# EAGLE schematic SensorInterface (EAGLE 8.5.1)

## Sheet 1 of 2
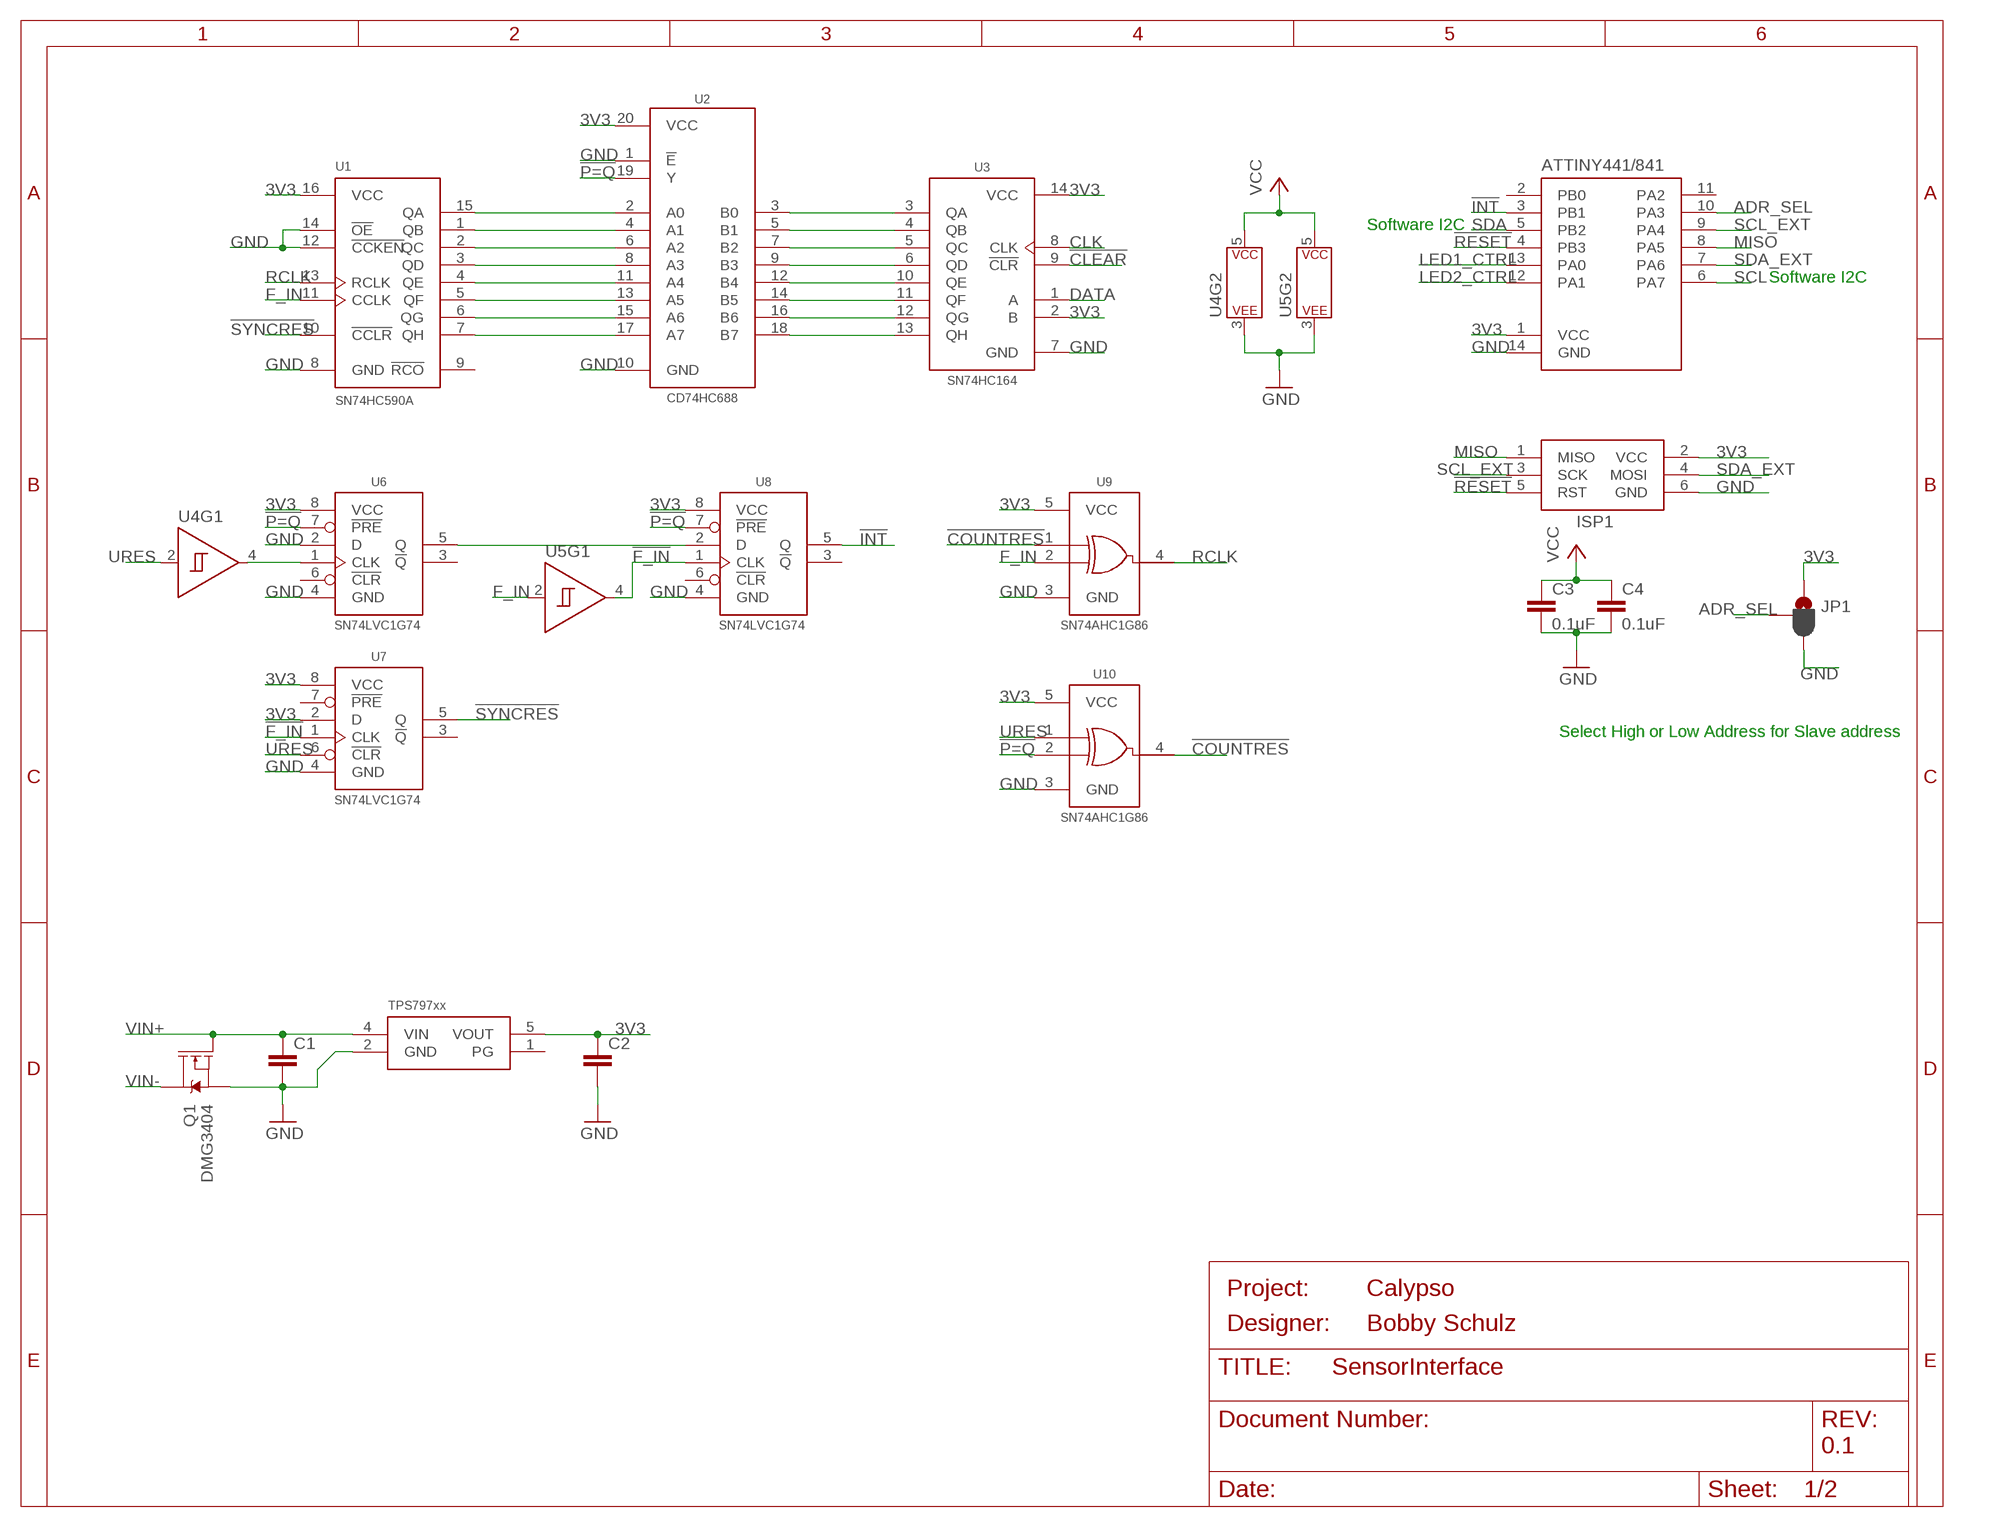
[diagram p0: schematic, sheet 1]
FRAME1 (FRAME_A_L): DESIGNER: Bobby Schulz; PROJECT: Calypso; REV: 0.1

### Parts
C1  C-EUC0603  [C0603]
C2  C-EUC0603  [C0603]
C3  0.1uF  C-EUC0603  [C0603]
C4  0.1uF  C-EUC0603  [C0603]
ISP1  AVRISP-6  [AVRISP]
JP1  JUMPER-SMT_3_1-NC_PASTE_SILK  [SMT-JUMPER_3_1-NC_PASTE_SILK]
Q1  DMG3404  MOSFET-NCH-DMG3404L  [SOT23-3]
U1  SN74HC590AD  [SO16]
U2  CD74HCT688DW  [SO-20DW]
U3  SN74HC164D  [SO14]
U4  SN74LVC1G14DCK  [DCK_R-PDSO-G5]
U5  SN74LVC1G14DCK  [DCK_R-PDSO-G5]
U6  SN74LVC1G74DCU  [DCU_(R-PDSO-G8)]
U7  SN74LVC1G74DCU  [DCU_(R-PDSO-G8)]
U8  SN74LVC1G74DCU  [DCU_(R-PDSO-G8)]
U9  SN74AHC1G86DCK  [DCK_R-PDSO-G5]
U10  SN74AHC1G86DCK  [DCK_R-PDSO-G5]
U$1  TPS79733  [DCK_R-PDSO-G5]
U$3  ATTINY441/841841  [SOIC_14]

### Nets
3V3: C2.1 C3.1 C4.1 ISP1.2(VCC) JP1.1 U1.16(VCC) U2.20(VCC) U3.2(B) U3.14(VCC) U4.5(P$V+) U5.5(P$V+) U6.8(VCC) U7.2(D) U7.8(VCC) U8.8(VCC) U9.5(VCC) U10.5(VCC) U$1.5(VOUT) U$3.1(VCC) ; supply symbol labelled VCC ; also sheet 2
!CLEAR: U3.9(!CLR)
!COUNTRES: U9.1(A) U10.4(Y)
!F_IN: U5.4(Y) U7.1(CLK) U8.1(CLK)
!INT: U8.5(Q) U$3.3(PB1)
!P=Q: U2.19(Y) U6.7(!PRE) U8.7(!PRE) U10.2(B)
!RESET: ISP1.5(RST) U$3.4(PB3)
!SYNCRES: U1.10(!CCLR) U7.5(Q)
ADR_SEL: JP1.2 U$3.10(PA3)
CLK: U3.8(CLK)
DATA: U3.1(A)
F_IN: U1.11(CCLK) U5.2(A) U9.2(B) ; also sheet 2
GND: C1.2 C2.2 C3.2 C4.2 ISP1.6(GND) JP1.3 Q1.2(S) U1.8(GND) U1.12(!CCKEN) U1.14(!OE) U2.1(!E) U2.10(GND) U3.7(GND) U4.3(P$V-) U5.3(P$V-) U6.2(D) U6.4(GND) U7.4(GND) U8.4(GND) U9.3(GND) U10.3(GND) U$1.2(GND) U$3.14(GND) ; also sheet 2
LED1_CTRL: U$3.13(PA0) ; also sheet 2
LED2_CTRL: U$3.12(PA1) ; also sheet 2
MISO: ISP1.1(MISO) U$3.8(PA5)
N$1: U1.15(QA) U2.2(A0)
N$2: U1.1(QB) U2.4(A1)
N$3: U1.2(QC) U2.6(A2)
N$4: U1.3(QD) U2.8(A3)
N$5: U1.4(QE) U2.11(A4)
N$6: U1.5(QF) U2.13(A5)
N$7: U1.6(QG) U2.15(A6)
N$8: U1.7(QH) U2.17(A7)
N$9: U2.3(B0) U3.3(QA)
N$10: U2.5(B1) U3.4(QB)
N$11: U2.7(B2) U3.5(QC)
N$12: U2.9(B3) U3.6(QD)
N$13: U2.12(B4) U3.10(QE)
N$14: U2.14(B5) U3.11(QF)
N$15: U2.16(B6) U3.12(QG)
N$16: U2.18(B7) U3.13(QH)
N$20: U4.4(Y) U6.1(CLK)
N$32: U6.5(Q) U8.2(D)
RCLK: U1.13(RCLK) U9.4(Y)
SCL: U$3.6(PA7) ; also sheet 2
SCL_EXT: ISP1.3(SCK) U$3.9(PA4) ; also sheet 2
SDA: U$3.5(PB2) ; also sheet 2
SDA_EXT: ISP1.4(MOSI) U$3.7(PA6) ; also sheet 2
URES: U4.2(A) U7.6(!CLR) U10.1(A)
VIN+: C1.1 Q1.1(G) U$1.4(VIN) ; also sheet 2
VIN-: Q1.3(D) ; also sheet 2
Unconnected: U1.9(!RCO) U6.3(!Q) U6.6(!CLR) U7.3(!Q) U7.7(!PRE) U8.3(!Q) U8.6(!CLR) U$1.1(PG) U$3.2(PB0) U$3.11(PA2)

### Notes on the sheet
- Software I2C
- Software I2C
- Select High or Low Address for Slave address

## Sheet 2 of 2
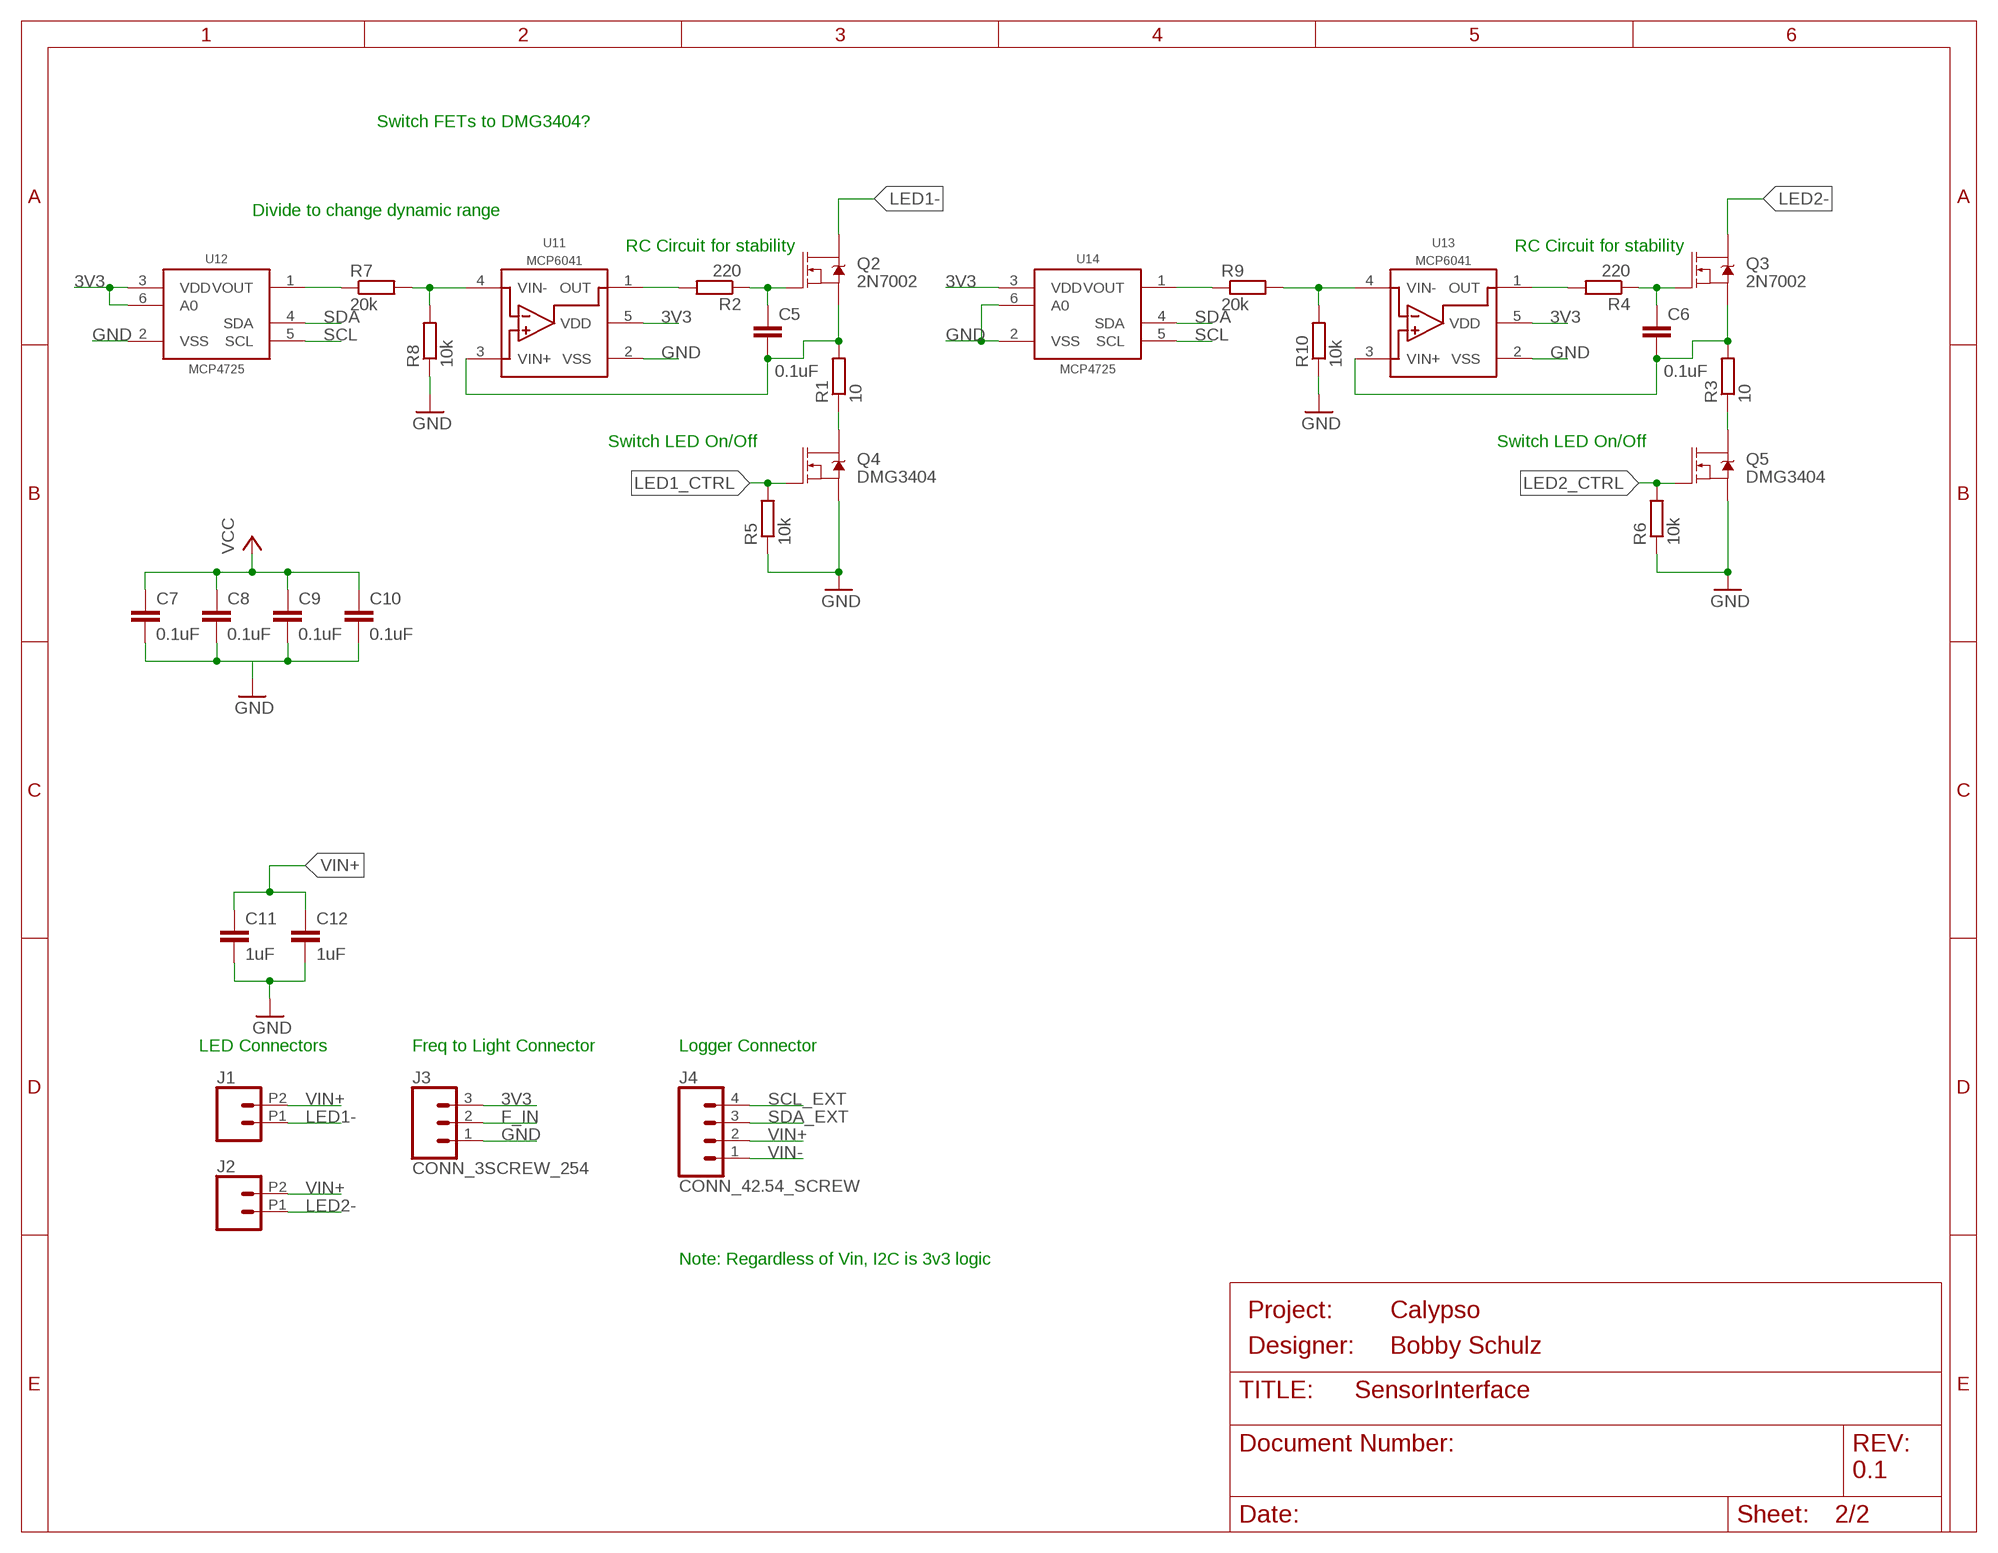
[diagram p1: schematic, sheet 2]
FRAME2 (FRAME_A_L): DESIGNER: Bobby Schulz; PROJECT: Calypso; REV: 0.1

### Parts
C5  0.1uF  C-EUC0603  [C0603]
C6  0.1uF  C-EUC0603  [C0603]
C7  0.1uF  C-EUC0603  [C0603]
C8  0.1uF  C-EUC0603  [C0603]
C9  0.1uF  C-EUC0603  [C0603]
C10  0.1uF  C-EUC0603  [C0603]
C11  1uF  C-EUC0603  [C0603]
C12  1uF  C-EUC0603  [C0603]
J1  CONN_02SCREW_2.54  [1X02_2.54_SCREWTERM]
J2  CONN_02SCREW_2.54  [1X02_2.54_SCREWTERM]
J3  CONN_3SCREW_254  [1X03_SCREW]
J4  CONN_42.54_SCREW  [1X04_SCREW]
Q2  2N7002  MOSFET-NCH-2N7002PW  [SOT323]
Q3  2N7002  MOSFET-NCH-2N7002PW  [SOT323]
Q4  DMG3404  MOSFET-NCH-DMG3404L  [SOT23-3]
Q5  DMG3404  MOSFET-NCH-DMG3404L  [SOT23-3]
R1  10  R-EU_R0603  [R0603]
R2  220  R-EU_R0603  [R0603]
R3  10  R-EU_R0603  [R0603]
R4  220  R-EU_R0603  [R0603]
R5  10k  R-EU_R0603  [R0603]
R6  10k  R-EU_R0603  [R0603]
R7  20k  R-EU_R0603  [R0603]
R8  10k  R-EU_R0603  [R0603]
R9  20k  R-EU_R0603  [R0603]
R10  10k  R-EU_R0603  [R0603]
U11  MCP6041  [SOT23-5]
U12  MCP4725A1  [SOT23-6L]
U13  MCP6041  [SOT23-5]
U14  MCP4725A1  [SOT23-6L]

### Nets
3V3: C7.1 C8.1 C9.1 C10.1 J3.3 U11.5(VDD) U12.3(VDD) U12.6(A0) U13.5(VDD) U14.3(VDD) ; supply symbol labelled VCC ; also sheet 1
F_IN: J3.2 ; also sheet 1
GND: C7.2 C8.2 C9.2 C10.2 C11.2 C12.2 J3.1 Q4.2(S) Q5.2(S) R5.1 R6.1 R8.1 R10.1 U11.2(VSS) U12.2(VSS) U13.2(VSS) U14.2(VSS) U14.6(A0) ; also sheet 1
LED1-: J1.P1 Q2.3(D)
LED1_CTRL: Q4.1(G) R5.2 ; also sheet 1
LED2-: J2.P1 Q3.3(D)
LED2_CTRL: Q5.1(G) R6.2 ; also sheet 1
N$17: R9.1 U14.1(VOUT)
N$18: R7.2 R8.2 U11.4(VIN-)
N$19: C6.2 Q3.2(S) R3.2 U13.3(VIN+)
N$21: C6.1 Q3.1(G) R4.1
N$22: C5.2 Q2.2(S) R1.2 U11.3(VIN+)
N$23: C5.1 Q2.1(G) R2.1
N$24: R2.2 U11.1(OUT)
N$25: R4.2 U13.1(OUT)
N$26: Q5.3(D) R3.1
N$27: Q4.3(D) R1.1
N$28: R7.1 U12.1(VOUT)
N$29: R9.2 R10.2 U13.4(VIN-)
SCL: U12.5(SCL) U14.5(SCL) ; also sheet 1
SCL_EXT: J4.4 ; also sheet 1
SDA: U12.4(SDA) U14.4(SDA) ; also sheet 1
SDA_EXT: J4.3 ; also sheet 1
VIN+: C11.1 C12.1 J1.P2 J2.P2 J4.2 ; also sheet 1
VIN-: J4.1 ; also sheet 1

### Notes on the sheet
- Switch FETs to DMG3404?
- Divide to change dynamic range
- RC Circuit for stability | RC Circuit for stability
- Switch LED On/Off | Switch LED On/Off
- LED Connectors | Freq to Light Connector | Logger Connector
- Note: Regardless of Vin, I2C is 3v3 logic

## Library data of the parts
C1-C12 = bschulz_passives:C-EU: CAPACITOR, European symbol
ISP1 = bschulz:AVRISP: AVR ISP HEADER Standard 6 pin header for AVR programming
J1 J2 = bschulz:CONN_02: Multi connection point. Often used as Generic Header-pin footprint for 0.1 inch spaced/style header connections On any of the 0.1 inch spaced packages, you can populate with these: Break Away Headers - Straight <https://www.sparkfun.com/products/116> (PRT-00116) Break Away Male Headers - Right Angle <https://www.sparkfun.com/products/553> (PRT-00553) Female Headers <https://www.sparkfun.com/products/115> (PRT-00115) Break Away Headers - Machine Pin <https://www.sparkfun.com/products/117> (PRT-00117) Break Away Female Headers - Swiss Machine Pin <https://www.sparkfun.com/products/743> (PRT-00743) For SCREWTERMINALS and SPRING TERMINALS visit here: Screw Terimnals on SparkFun.com <https://www.sparkfun.com/search/results?term=Screw+Terminals> (5mm/3.5mm/2.54mm spacing) This device is also useful as a general connection point to wire up your design to another part of your project. Our various solder wires solder well into these plated through hole pads. Hook-Up Wire - Assortment (Stranded, 22 AWG) <https://www.sparkfun.com/products/11375> (PRT-11375) Hook-Up Wire - Assortment (Solid Core, 22 AWG) <https://www.sparkfun.com/products/11367> (PRT-11367) View the entire wire category on our website here <https://www.sparkfun.com/categories/141> Special notes: Molex polarized connector foot print use with: PRT-08233 with associated crimp pins and housings. 2.54_SCREWTERM for use with PRT-10571. 3.5mm Screw Terminal footprints for PRT-08084 5mm Screw Terminal footprints for use with PRT-08432; DIGIKEY: ED10561-ND; MF: OnShore; MPN: OSTVN02A150
J3 = bschulz:CONN_3: Genaric 3 pin connector
J4 = bschulz:CONN_4: Genaric 4 pin connector
JP1 = SparkFun-Jumpers:JUMPER-SMT_3_1-NC_PASTE: Normally closed solder jumper (1 of 2 connections) This jumper has an aperture in the stencil to allow solder paste to bridge one of the two connections. One connection is normally closed (NC), while the other is normally open (NO). Wick off the solder to open the connection. Reapply solder to reclose the connection. Apply solder to the other side instead to change the current path.
Q1 Q4 Q5 = bschulz:MOSFET-NCH: N-channel MOSFETs Voltage controlled devices that allow control of high current outputs. SparkFun Products: SparkFun OpenScale <https://www.sparkfun.com/products/13261> SparkFun Digital Sandbox <https://www.sparkfun.com/products/12651> SparkFun Monster Moto Shield <https://www.sparkfun.com/products/10182> SparkFun MOSFET Power Controller <https://www.sparkfun.com/products/11214>; DIGIKEY: DMG3404L-7DICT-ND; MF: Diodes Incorporated; MPN: DMG3404L-7
Q2 Q3 = bschulz:MOSFET-NCH: N-channel MOSFETs Voltage controlled devices that allow control of high current outputs. SparkFun Products: SparkFun OpenScale <https://www.sparkfun.com/products/13261> SparkFun Digital Sandbox <https://www.sparkfun.com/products/12651> SparkFun Monster Moto Shield <https://www.sparkfun.com/products/10182> SparkFun MOSFET Power Controller <https://www.sparkfun.com/products/11214>; DIGIKEY: 2N7002W-FDICT-ND; MF: Diodes Incorporated; MPN: 2N7002W-7-F; PROD_ID: TRANS-11151
R1-R10 = bschulz_passives:R-EU_: RESISTOR, European symbol; MF: Yageo
U1 = bschulz:SN74HC590A: SN74HC590A - 8 bit binary counter with direct clear Characteristics: VCC: 2~6V Operating Temperature: -40°C to 85°C fmax = 2.5 MHz (for Vcc = 2v, high for higher Vcc) Digikey: 296-8340-5-ND (SOIC) <https://www.digikey.com/product-detail/en/texas-instruments/SN74HC590AD/296-8340-5-ND/376756> 296-1599-5-ND (DIP) <https://www.digikey.com/product-detail/en/texas-instruments/SN74HC590AN/296-1599-5-ND/277245>; DIGIKEY: 296-8340-5-ND; MF: TI; MPN: SN74HC590AD
U2 = bschulz:CD74HCT688: CD74HC688 - 8 bit Magnatude Comparator Characteristics: VCC: 2~6V Operating Temperature: -55°C to 125°C Output: Active Low Digikey: 296-28201-1-ND (TSSOP) <https://www.digikey.com/product-detail/en/texas-instruments/CD74HC688PWT/296-28201-1-ND/2523385> 296-38069-1-ND (SOIC) <https://www.digikey.com/product-detail/en/texas-instruments/CD74HC688M96/296-38069-1-ND/4967274> 296-33117-5-ND (DIP) <https://www.digikey.com/product-detail/en/texas-instruments/CD74HC688E/296-33117-5-ND/1507427>
U3 = bschulz:SN74HC164: SN74HC164 - 8 bit SIPO Shift Register Characteristics: VCC: 2~6V Operating Temperature: -40°C to 125°C fmax = 6 MHz (for Vcc = 2v, high for higher Vcc) Digikey: 296-14020-1-ND (TSSOP) <https://www.digikey.com/product-detail/en/texas-instruments/SN74HC164PWR/296-14020-1-ND/522545> 296-14838-1-ND (SOIC) <https://www.digikey.com/product-detail/en/texas-instruments/SN74HC164DR/296-14838-1-ND/562706> 296-8248-5-ND (DIP) <https://www.digikey.com/products/en/integrated-circuits-ics/logic-shift-registers/712?k=sn74hc164&k=&pkeyword=sn74hc164&pv69=80&FV=ffe002c8&quantity=0&ColumnSort=0&page=1&stock=1&pageSize=25>; DIGIKEY: 296-14838-1-ND; MF: TI; MPN: SN74HC164DR
U4 U5 = bschulz:SN74*1G14: SN74x1G14 - Single Schmitt Triger Inverter Characteristics: VCC: 0.8 ~ 3.6V (1.65 ~ 5.5V for LVC Version) Operating Temperature: -40°C to 85°C (-40°C to 125°C for LVC Version) fmax = 2.5 MHz (for Vcc =1.65v, high for higher Vcc) Output Current = ± 4 mA (± 32 mA for LVC Version) Digikey: 296-19076-1-ND (AUP Low Voltage) <https://www.digikey.com/product-detail/en/texas-instruments/SN74AUP1G14DCKR/296-19076-1-ND/864307> 296-47215-1-ND (LVC High Voltage) <https://www.digikey.com/product-detail/en/texas-instruments/SN74LVC1G14DCKR/296-11608-1-ND/385747>; DIGIKEY: 296-11608-1-ND; MF: TI; MPN: SN74LVC1G14DCKR
U6-U8 = bschulz:SN74LVC1G74: SN74LVC1G74 - D-Type Flip Flop with Clear and Preset, 1 Element Characteristics: VCC: 2 ~ 6V Edge Trigger: Positive Edge Operating Temperature: -40°C to 85°C Digikey: 296-25554-1-ND (VFSOP ) <https://www.digikey.com/product-detail/en/texas-instruments/SN74LVC1G74DCUR/296-25554-1-ND/2195379>; DIGIKEY: 296-25554-1-ND; MF: TI; MPN: SN74LVC1G74DCUR
U9 U10 = bschulz:SN74AHC1G86: SN74AHC1G86 - XOR, 1 Element, 2 Input Characteristics: VCC: 2 ~ 6V IQ = 1μA Operating Temperature: -40°C to 85°C Digikey: 296-8750-1-ND (SC-70) <https://www.digikey.com/product-detail/en/texas-instruments/SN74AHC1G86DCKR/296-8750-1-ND/373813>; DIGIKEY: 296-8750-1-ND; MF: TI; MPN: SN74AHC1G86DCKR
U11 U13 = bschulz:MCP6041: MCP6041 - Low Power Rail to Rail Op-Amp Characteristics: Vs: 1.4V ~ 6V Iq: 600nA Common Mode Range: 0V ~ 6V GBP: 14 kHz Operating Temperature: -40°C to 125°C Digikey: MCP6041T-I/OTCT-ND <https://www.digikey.com/product-detail/en/microchip-technology/MCP6041T-I-OT/MCP6041T-I-OTCT-ND/529846>; DIGIKEY: MCP6041T-I/OTCT-ND; DISP: MCP6041; MF: Microchip; MPN: MCP6041T-I/OT
U12 U14 = bschulz:MCP4725*: MCP4725 - 12 Bit Digital to Analog Converter Characteristics: VCC: 2.7~5.5V Operating Temperature: -40°C to 125°C Number of Outputs: 1 Settling Time: 6μs Number of Bits: 12 Digikey: MCP4725A0T-E/CHCT-ND <https://www.digikey.com/product-detail/en/microchip-technology/MCP4725A0T-E-CH/MCP4725A0T-E-CHCT-ND/1817328> MCP4725A1T-E/CHCT-ND <https://www.digikey.com/product-detail/en/microchip-technology/MCP4725A1T-E-CH/MCP4725A1T-E-CHCT-ND/1999839> MCP4725A3T-E/CHCT-ND <https://www.digikey.com/product-detail/en/microchip-technology/MCP4725A3T-E-CH/MCP4725A3T-E-CHCT-ND/1999841>; DIGIKEY: MCP4725A1T-E/CHCT-ND; MF: Microchip; MPN: MCP4725A1T-E/CH
U$1 = bschulz:TPS797*: TPS797xx, Ultra low power linear voltage regulator, fixed voltages of 1.8v, 3v, 3.3v Input voltage rage of 1.8-5.5v; DIGIKEY: 296-11990-1-ND; MF: TI; MPN: TPS79733DCKR
U$3 = bschulz:ATTINY441/841: ATTINY441, ATTINY841 8 bit MCU, 4/8k flash, 256/512B SRAM; DIGIKEY: ATTINY841-SSU-ND; MF: Atmel; MPN: ATTINY841-SSU